# EAGLE design MEMS-preamp_v06_INPROGRESS (EAGLE 8.5.0)
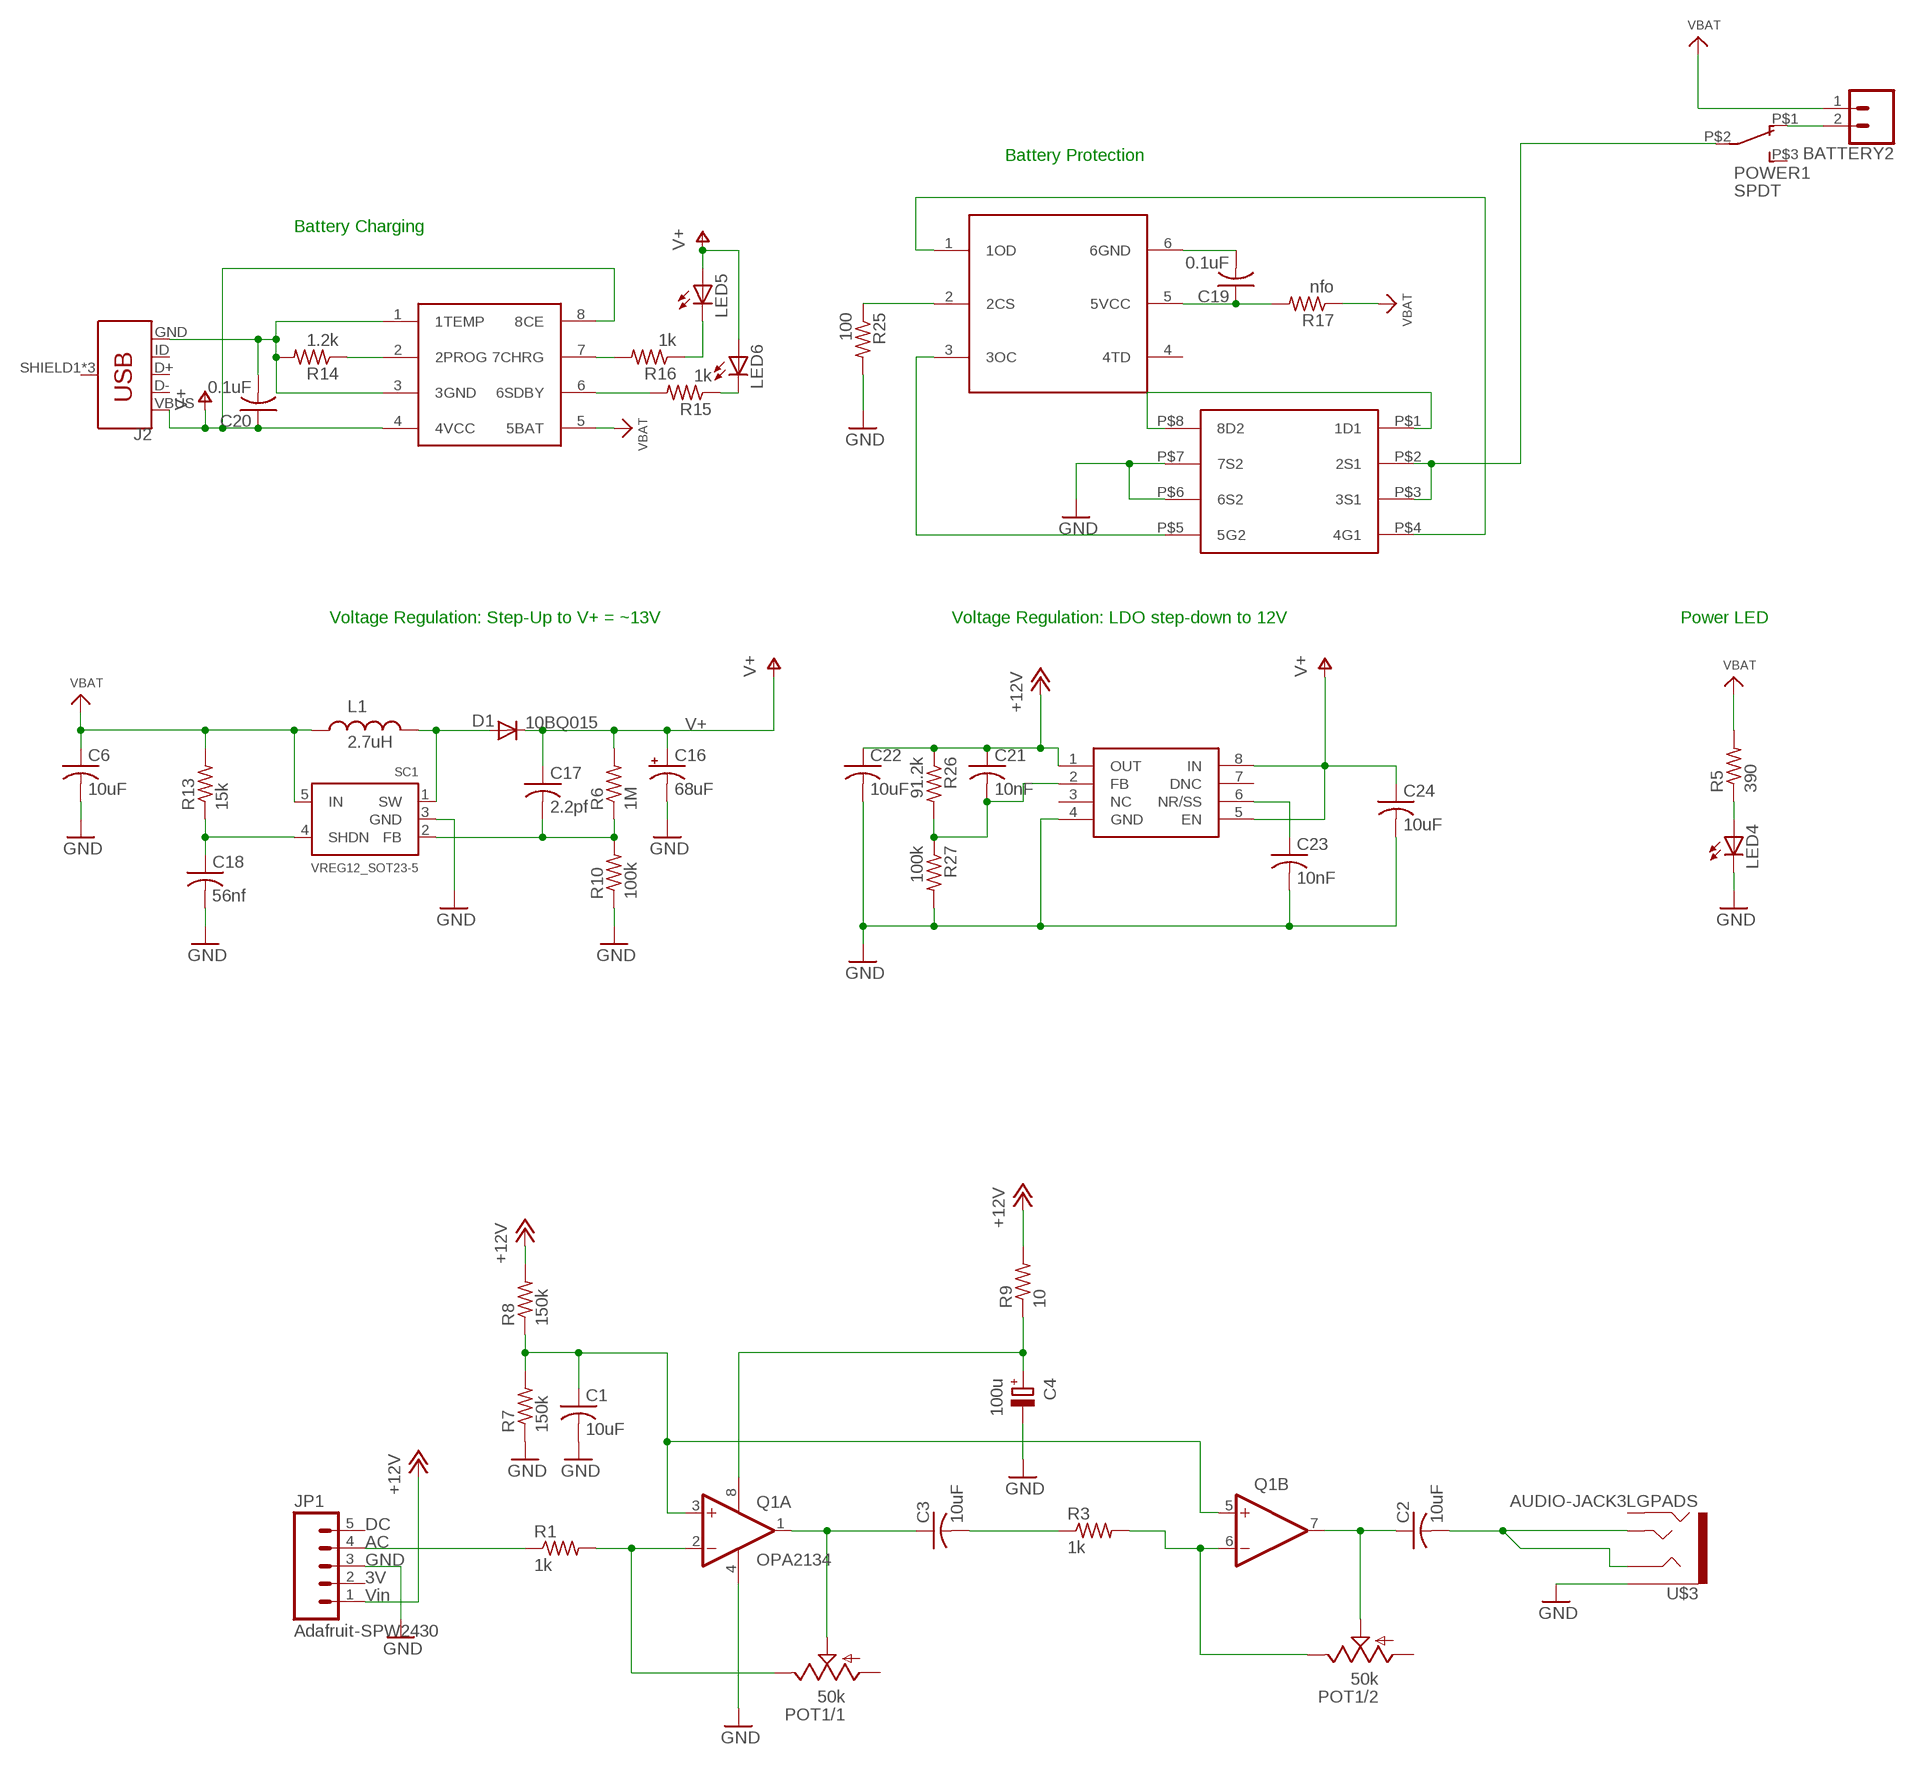
[diagram p0: schematic, sheet 1]

## Parts
BATTERY2  CONN_02LOCK  [1X02_LOCK]
C1  10uF  C-USC0603  [C0603]
C2  10uF  C-USC0603  [C0603]
C3  10uF  C-USC0805  [C0805]
C4  100u  CPOL-EUCT7343  [CT7343]
C6  10uF  C-USC0805  [C0805]
C16  68uF  CAP_POL3528  [EIA3528]
C17  2.2pf  C-USC0805  [C0805]
C18  56nf  C-USC0805  [C0805]
C19  0.1uF  C-USC0805  [C0805]
C20  0.1uF  C-USC0805  [C0805]
C21  10nF  C-USC0805  [C0805]
C22  10uF  C-USC0805  [C0805]
C23  10nF  C-USC0805  [C0805]
C24  10uF  C-USC0805  [C0805]
D1  10BQ015  DIODESMA  [SMA-DIODE]
DW01A1  DW01A  [SOT23-6]
F8205A1  F8205A  [F8205A]
J2  USB_MICRO-BREDUCED_PASTE  [USB-B-MICRO-SMD_RED_PASTE]
JP1  Adafruit-SPW2430  M05LOCK  [1X05_LOCK]
L1  2.7uH  INDUCTORCR54  [CR54]
LED4  LED3MM  [LED3MM]
LED5  LED3MM  [LED3MM]
LED6  LED3MM  [LED3MM]
POT1  50k  POT-DUAL-PTV112-4420  [PTV112]
POWER1  SPDT  SWITCH_SPDTCL-SB-12B  [SWITCH_SPDT_CL-SB-12B]
Q1  OPA2134  OPA2134UA  [SO08]
R1  1k  R-US_R0603  [R0603]
R3  1k  R-US_R0603  [R0603]
R5  390  R-US_R0805  [R0805]
R6  1M  R-US_R0603  [R0603]
R7  150k  R-US_R0603  [R0603]
R8  150k  R-US_R0603  [R0603]
R9  10  R-US_R0603  [R0603]
R10  100k  R-US_R0603  [R0603]
R13  15k  R-US_R0603  [R0603]
R14  1.2k  R-US_R0603  [R0603]
R15  1k  R-US_R0603  [R0603]
R16  1k  R-US_R0603  [R0603]
R17  nfo  R-US_R0603  [R0603]
R25  100  R-US_R0603  [R0603]
R26  91.2k  R-US_R0603  [R0603]
R27  100k  R-US_R0603  [R0603]
SC1  VREG12_SOT23-5  [SOT23-5]
TP1  TP4056-CHIP  [SO08]
U$3  AUDIO-JACK3LGPADS  [TRRS_SJ-43514-SMT-TR]
U$13  TPS7A49  [MSOP-8]

## Nets
+12V: C21.1 C22.1 JP1.1 R8.2 R9.2 R26.1 U$13.1(OUT)
GND: C1.2 C4.- C6.2 C16.C(-) C18.2 C22.2 C23.2 C24.2 F8205A1.P$6(6S2) F8205A1.P$7(7S2) JP1.3 LED4.K(C) Q1.4(A:V-) R7.1 R10.1 R25.2 R27.2 SC1.3(GND) U$3.EARTH U$13.4(GND)
GROU[: POT1.2.3(/2:E) Q1.6(B:-IN) R3.2
N$1: C4.+ Q1.8(A:V+) R9.1
N$2: LED4.A R5.1
N$3: JP1.4 R1.1
N$4: C3.2 R3.1
N$5: POT1.1.3(/1:E) Q1.2(A:-IN) R1.2
N$6: F8205A1.P$2(2S1) F8205A1.P$3(3S1) POWER1.P$2
N$7: C2.2 U$3.RING1 U$3.TIP
N$8: C1.1 Q1.3(A:+IN) Q1.5(B:+IN) R7.2 R8.1
N$9: C3.1 POT1.1.2(/1:S) Q1.1(A:OUT)
N$10: C2.1 POT1.2.2(/2:S) Q1.7(B:OUT)
N$11: BATTERY2.2 POWER1.P$1
N$12: D1.A L1.P$2 SC1.1(SW)
N$13: C18.1 R13.1 SC1.4(SHDN)
N$14: C17.2 R6.1 R10.2 SC1.2(FB)
N$15: C20.2 J2.GND R14.2 TP1.1(1TEMP) TP1.3(3GND)
N$16: R14.1 TP1.2(2PROG)
N$17: R16.2 TP1.7(7CHRG)
N$19: R15.2 TP1.6(6SDBY)
N$22: LED6.K(C) R15.1
N$23: LED5.K(C) R16.1
N$24: DW01A1.1(1OD) F8205A1.P$4(4G1)
N$25: DW01A1.3(3OC) F8205A1.P$5(5G2)
N$27: C19.1 DW01A1.5(5VCC) R17.2
N$31: C19.2 DW01A1.6(6GND)
N$45: DW01A1.2(2CS) R25.1
N$46: F8205A1.P$1(1D1) F8205A1.P$8(8D2)
N$47: C21.2 R26.2 R27.1 U$13.2(FB)
N$48: C23.1 U$13.6(NR/SS)
V+: C16.A(+) C17.1 C20.1 C24.1 D1.C J2.VBUS LED5.A LED6.A R6.2 TP1.4(4VCC) TP1.8(8CE) U$13.5(EN) U$13.8(IN)
VBAT: BATTERY2.1 C6.1 L1.P$1 R5.2 R13.2 R17.1 SC1.5(IN) TP1.5(5BAT)
Unconnected: DW01A1.4(4TD) J2.D+ J2.D- J2.ID J2.SHIELD1(SHIELD) J2.SHIELD2(SHIELD) J2.SHIELD3(SHIELD) JP1.2 JP1.5 POT1.1.1(/1:A) POT1.2.1(/2:A) POWER1.P$3 U$3.RING2 U$13.3(NC) U$13.7(DNC)

## Notes on the sheet
- Battery Protection
- Battery Charging
- Voltage Regulation: Step-Up to V+ = ~13V | Voltage Regulation: LDO step-down to 12V | Power LED

## Library data of the parts
BATTERY2 = SparkFun-Connectors:CONN_02: Multi connection point. Often used as Generic Header-pin footprint for 0.1 inch spaced/style header connections On any of the 0.1 inch spaced packages, you can populate with these: Break Away Headers - Straight <https://www.sparkfun.com/products/116> (PRT-00116) Break Away Male Headers - Right Angle <https://www.sparkfun.com/products/553> (PRT-00553) Female Headers <https://www.sparkfun.com/products/115> (PRT-00115) Break Away Headers - Machine Pin <https://www.sparkfun.com/products/117> (PRT-00117) Break Away Female Headers - Swiss Machine Pin <https://www.sparkfun.com/products/743> (PRT-00743) For SCREWTERMINALS and SPRING TERMINALS visit here: Screw Terimnals on SparkFun.com <https://www.sparkfun.com/search/results?term=Screw+Terminals> (5mm/3.5mm/2.54mm spacing) This device is also useful as a general connection point to wire up your design to another part of your project. Our various solder wires solder well into these plated through hole pads. Hook-Up Wire - Assortment (Stranded, 22 AWG) <https://www.sparkfun.com/products/11375> (PRT-11375) Hook-Up Wire - Assortment (Solid Core, 22 AWG) <https://www.sparkfun.com/products/11367> (PRT-11367) View the entire wire category on our website here <https://www.sparkfun.com/categories/141> Special notes: Molex polarized connector foot print use with: PRT-08233 with associated crimp pins and housings. 2.54_SCREWTERM for use with PRT-10571. 3.5mm Screw Terminal footprints for PRT-08084 5mm Screw Terminal footprints for use with PRT-08432
C1-C3 C6 C17-C24 = adafruit:C-US: CAPACITOR, American symbol
C4 = rcl:CPOL-EU: POLARIZED CAPACITOR, European symbol
C16 = SparkFun:CAP_POL: Capacitor Polarized These are standard SMD and PTH capacitors. Normally 10uF, 47uF, and 100uF in electrolytic and tantalum varieties. Always verify the external diameter of the through hole cap, it varies with capacity, voltage, and manufacturer. The EIA devices should be standard.
D1 = SparkFun:DIODE: Diode These are standard reverse protection diodes and small signal diodes. SMA package can handle up to about 1A. SOD-323 can handle about 200mA. What the SOD-323 package when ordering, there are some mfgs out there that are 5-pin packages.
DW01A1 = CMU-ArtFab:DW01A
F8205A1 = CMU-ArtFab:F8205A
J2 = SparkFun-Connectors:USB_MICRO-B: USB Type Micro-B Connector Male/female and PTH/SMT variants SparkFun Products: SparkFun microB USB Breakout <https://www.sparkfun.com/products/12035> SparkFun USB microB Plug Breakout <https://www.sparkfun.com/products/10031> SparkFun ESP8266 Thing <https://www.sparkfun.com/products/13231>; PROD_ID: CONN-11752
JP1 = SparkFun-Connectors:M05: Header 5 Standard 5-pin 0.1" header. Use with straight break away headers (SKU : PRT-00116), right angle break away headers (PRT-00553), swiss pins (PRT-00743), machine pins (PRT-00117), and female headers (PRT-00115). Molex polarized connector foot print use with SKU : PRT-08230 with associated crimp pins and housings.; CON1: Vin; CON2: 3V; CON3: GND; CON4: AC; CON5: DC
L1 = SparkFun:INDUCTOR: Inductors Basic Inductor/Choke - 0603 and 1206. Footprints are not proven and vary greatly between part numbers.
LED4-LED6 = led:LED: LED OSRAM: - CHIPLED LG R971, LG N971, LY N971, LG Q971, LY Q971, LO R971, LY R971 LH N974, LH R974 LS Q976, LO Q976, LY Q976 LO Q996 - Hyper CHIPLED LW Q18S LB Q993, LB Q99A, LB R99A - SideLED LS A670, LO A670, LY A670, LG A670, LP A670 LB A673, LV A673, LT A673, LW A673 LH A674 LY A675 LS A676, LA A676, LO A676, LY A676, LW A676 LS A679, LY A679, LG A679 - Hyper Micro SIDELED® LS Y876, LA Y876, LO Y876, LY Y876 LT Y87S - SmartLED LW L88C, LW L88S LB L89C, LB L89S, LG L890 LS L89K, LO L89K, LY L89K LS L896, LA L896, LO L896, LY L896 - TOPLED LS T670, LO T670, LY T670, LG T670, LP T670 LSG T670, LSP T670, LSY T670, LOP T670, LYG T670 LG T671, LOG T671, LSG T671 LB T673, LV T673, LT T673, LW T673 LH T674 LS T676, LA T676, LO T676, LY T676, LB T676, LH T676, LSB T676, LW T676 LB T67C, LV T67C, LT T67C, LS T67K, LO T67K, LY T67K, LW E67C LS E67B, LA E67B, LO E67B, LY E67B, LB E67C, LV E67C, LT E67C LW T67C LS T679, LY T679, LG T679 LS T770, LO T770, LY T770, LG T770, LP T770 LB T773, LV T773, LT T773, LW T773 LH T774 LS E675, LA E675, LY E675, LS T675 LS T776, LA T776, LO T776, LY T776, LB T776 LHGB T686 LT T68C, LB T68C - Hyper Mini TOPLED® LB M676 - Mini TOPLED Santana® LG M470 LS M47K, LO M47K, LY M47K Source: http://www.osram.convergy.de LUXEON: - LUMILED® LXK2-PW12-R00, LXK2-PW12-S00, LXK2-PW14-U00, LXK2-PW14-V00 LXK2-PM12-R00, LXK2-PM12-S00, LXK2-PM14-U00 LXK2-PE12-Q00, LXK2-PE12-R00, LXK2-PE12-S00, LXK2-PE14-T00, LXK2-PE14-U00 LXK2-PB12-K00, LXK2-PB12-L00, LXK2-PB12-M00, LXK2-PB14-N00, LXK2-PB14-P00, LXK2-PB14-Q00 LXK2-PR12-L00, LXK2-PR12-M00, LXK2-PR14-Q00, LXK2-PR14-R00 LXK2-PD12-Q00, LXK2-PD12-R00, LXK2-PD12-S00 LXK2-PH12-R00, LXK2-PH12-S00 LXK2-PL12-P00, LXK2-PL12-Q00, LXK2-PL12-R00 Source: www.luxeon.com KINGBRIGHT: KA-3528ASYC Source: www.kingbright.com
POT1 = CMU-ArtFab:POT-DUAL-PTV112: Bourns 11mm dual potentiometer; AVAILABILITY: Unavailable; DESCRIPTION: Alt# Tce-10111410; MF: STMicroelectronics; MP: PTV112; PACKAGE: None; PRICE: None
POWER1 = CMU-ArtFab:SWITCH_SPDT
Q1 = linear:OPA2*: Dual Operational Amplifier Low Power, Single-Supply, Rail-To-Rail Operational Amplifier Source: http://focus.ti.com/lit/ds/symlink/opa2345.pdf http://focus.ti.com .. opa241.pdf http://focus.ti.com/lit/ds/symlink/opa2134.pdf; IC_NAME: OPA2134
R1 R3 R5-R10 R13-R17 R25-R27 = CMU-ArtFab:R-US_: RESISTOR, American symbol
SC1 = CMU-ArtFab:VREG12_SOT23-5: SOT23-5 Fixed Voltage Regulators To better organise some of the SOT23-5 fixed voltage regulators in this library, this new part was created. Part Current Out V Out V In V Dropout Digikey Part No. ADP121 150mA 3.3V 3.4-5.5V 0.09V @ 150mA ADP121-AUJZ33R7CT-ND ADP121 150mA 3.0V 3.1-5.5V 0.09V @ 150mA ADP121-AUJZ30R7CT-ND ADP122 300mA 3.3V 3.4-5.5V 0.085V @ 300mA ADP122AUJZ-3.3-R7CT-ND ADP1712 300mA 3.3V 3.5-5.5V 0.17V @ 300mA ADP1712AUJZ-3.3-R7TR-ND AP7311 (Low Cost) 150mA 3.3V 3.5-6V 0.15V @ 150mA AP7311-33WG-7DICT-ND LD39015M18R 150mA 1.8V 1.9V-5.5V 0.08V @ 100mA 497-6977-1-ND MCP1824T-3302E/OT 300mA 3.3V 3.5V-6V 0.2V @ 300mA MCP1824T-3302E/OTCT-ND MIC5205-2.5YM5 TR 150mA 2.5V 2.7-16V 0.165V @ 150mA 576-1257-2-ND MIC5205-3.0YM5 TR 150mA 3.0V 3.2V-16V 0.165V @ 150mA 576-1258-2-ND MIC5205-3.3YM5 TR 150mA 3.3V 3.5V-16V 0.165V @ 150mA 576-1259-2-ND TPS780330220 150mA 3.3V+2.2V 3.6-5.5V 250mV Max 296-23332-1-ND TDA3663/N1,135 100mA 3.3V 3.5-45V 0.18V @ 50mA 568-5343-1-ND
TP1 = CMU-ArtFab:TP4056-CHIP
U$3 = CMU-ArtFab:AUDIO-JACK3: Audio jack - 3.5mm TRRS variety - two rings.
U$13 = CMU-ArtFab:TPS7A49

## Board
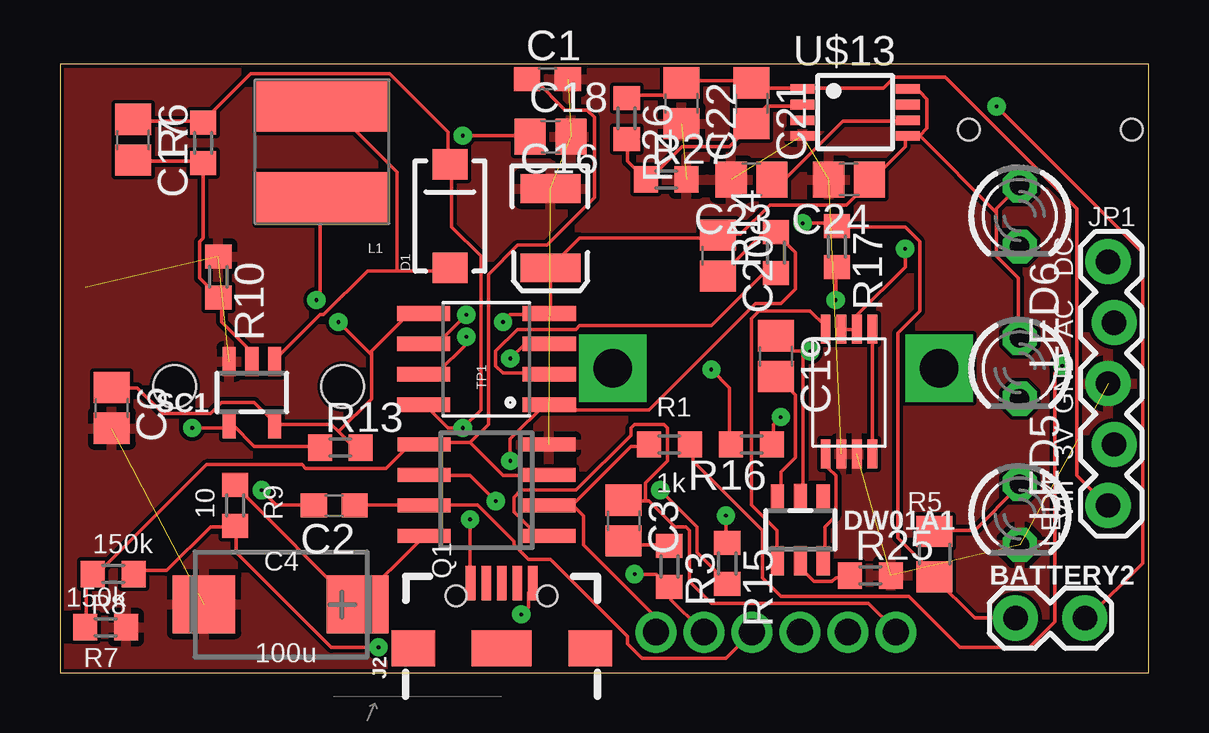
[diagram p1: board, top side]
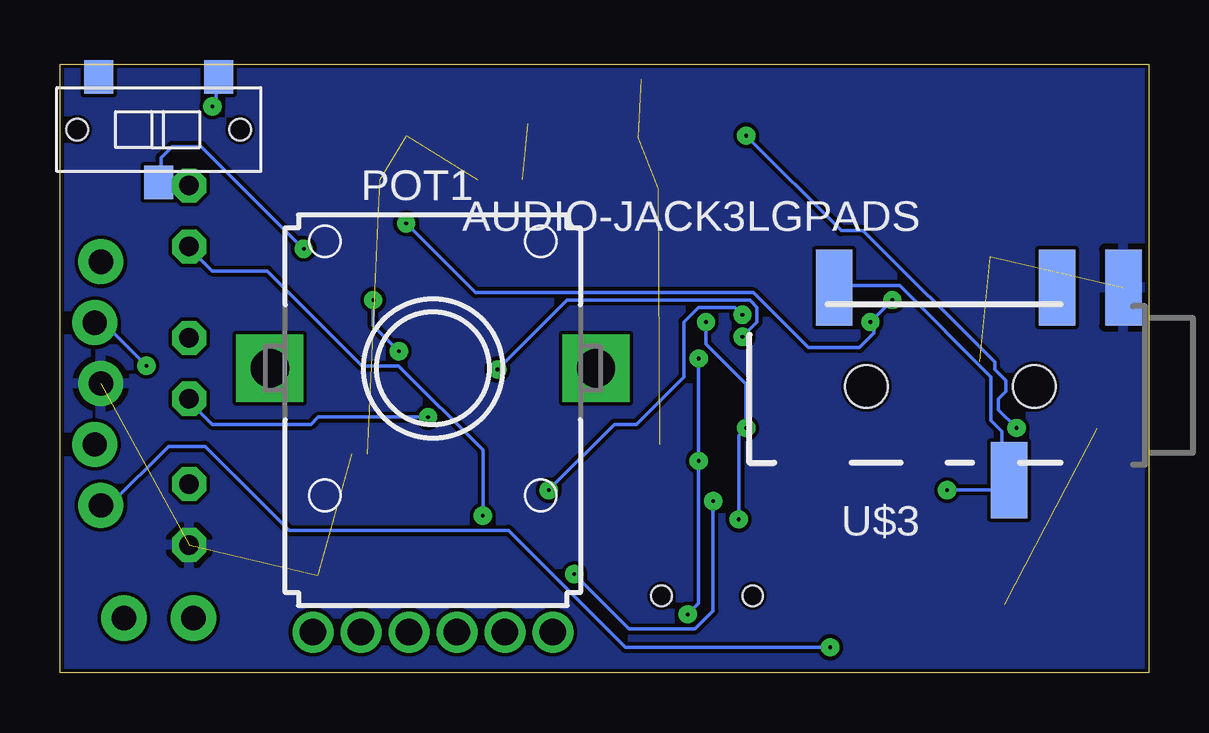
[diagram p2: board, bottom side, seen from below]

Size 45.39 x 25.39 mm. Coordinates in mm from the lower left corner, seen from the top.
Outline: 0,0 45.39,0 45.39,25.39 0,25.39 0,0
Copper layers (1*16): Top 0.035mm / dielectric 1.5mm / Bottom 0.035mm
Design rules "default *": minimum track width 6mil, minimum drill 6mil, track to track 6mil, track to pad 6mil, pad to pad 6mil, via to via 6mil, smd to smd 6mil, copper to edge 6mil, drill to drill 6mil, minimum pad ring 12mil, minimum via ring 12mil, stop-mask expansion 4mil, vias tented up to drill 0mil, thermal gap 10mil

### Footprints (pad centres in the part's own frame; a part is rotated, then mirrored left to right if it is on the bottom)
1X02_LOCK = drill 1.016 pad 1.88: 1 -0.178,0; 2 2.718,0
C0603 = smd 1.1 x 1: 1 -0.85,0; 2 0.85,0
C0805 = smd 1.3 x 1.5: 1 -0.85,0; 2 0.85,0
CT7343 = smd 2.6 x 2.4: + -3.2,0; - 3.2,0
EIA3528 = smd 1.2 x 2.5: A 1.65,0; C -1.65,0
SMA-DIODE = smd 1.27 x 1.47: A -2.15,0; C 2.15,0
SOT23-6 = smd 0.55 x 1.2: 1 -0.95,-1.3; 2 0,-1.3; 3 0.95,-1.3; 4 0.95,1.3; 5 0,1.303; 6 -0.95,1.3
F8205A = smd 0.406 x 1.2: P$1 -0.975,-2.65; P$2 -0.325,-2.65; P$3 0.325,-2.65; P$4 0.975,-2.65; P$5 0.975,2.55; P$6 0.325,2.55; P$7 -0.325,2.55; P$8 -0.975,2.55
USB-B-MICRO-SMD_RED_PASTE = smd 1.45 x 0.4: D+ 2.725,0; D- 2.725,0.65; GND 2.725,-1.3; ID 2.725,-0.65; VBUS 2.725,1.3 | smd 1.5 x 1.8: SHIELD1 0,3.685; SHIELD2 0,-3.685 | smd 1.5 x 2.5: SHIELD3 0,0 | hole 0.85: 2.2,1.9; 2.2,-1.9
1X05_LOCK = drill 1.016 pad 1.88: 1 0,0.127; 2 2.54,-0.127; 3 5.08,0.127; 4 7.62,-0.127; 5 10.16,0.127
CR54 = smd 5.5 x 2.15: P$1 0,1.92; P$2 0,-1.92
LED3MM = drill 0.813 octagon: A -1.27,0; K 1.27,0
PTV112 = drill 1.1 pad 1.676: 1.1 -3,-11; 1.2 -5,-11; 1.3 5,-11; 2.1 -1,-11; 2.2 1,-11; 2.3 3,-11 | drill 1.6 pad 2.8 square: M1 -6.8,0; M2 6.8,0
SWITCH_SPDT_CL-SB-12B = smd 1.2 x 1.4: P$1 -2.5,-2.2; P$2 0,2.2; P$3 2.5,-2.2 | hole 0.9: -3.4,0; 3.4,0
SO08 = smd 0.6 x 2.2: 1 -1.905,-2.6; 2 -0.635,-2.6; 3 0.635,-2.6; 4 1.905,-2.6; 5 1.905,2.6; 6 0.635,2.6; 7 -0.635,2.6; 8 -1.905,2.6
R0603 = smd 1 x 1.1: 1 -0.85,0; 2 0.85,0
R0805 = smd 1.3 x 1.5: 1 -0.95,0; 2 0.95,0
SOT23-5 = smd 0.55 x 1.2: 1 -0.95,-1.3; 2 0,-1.3; 3 0.95,-1.3; 4 0.95,1.3; 5 -0.95,1.3
SO08' = smd 0.61 x 2.21: 1 -1.905,-2.616; 2 -0.635,-2.616; 3 0.635,-2.616; 4 1.905,-2.616; 5 1.905,2.616; 6 0.635,2.616; 7 -0.635,2.616; 8 -1.905,2.616
TRRS_SJ-43514-SMT-TR = smd 1.524 x 3.175: EARTH -2.114,-5.271; RING1 2.644,2.759; RING2 0.66,-5.271; TIP 9.948,-5.271 | hole 1.778: 1.6,-1.15; 8.6,-1.15
MSOP-8 = smd 0.4 x 1: 1 -0.975,-2.2; 2 -0.325,-2.2; 3 0.325,-2.2; 4 0.975,-2.2; 5 0.975,2.2; 6 0.325,2.2; 7 -0.325,2.2; 8 -0.975,2.2

### Placement (x,y rotation side)
BATTERY2  40.01,2.29 0 top
C1  20.32,24.77 0 top
C2  11.43,6.99 180 top
C3  23.5,6.35 270 top
C4  9.21,2.86 180 top
C6  2.16,11.05 270 top
C16  20.45,18.54 270 top
C17  3.05,22.23 270 top
C18  20.45,22.35 0 top
C19  29.84,13.21 270 top
C20  27.43,17.4 270 top
C21  28.83,23.75 270 top
C22  25.91,23.75 270 top
C23  28.83,20.57 180 top
C24  32.89,20.57 180 top
D1  16.26,19.05 90 top
DW01A1  30.86,5.97 0 top
F8205A1  32.89,11.68 180 top
J2  18.41,1.02 90 top
JP1  43.81,6.99 90 top
L1  10.92,21.72 180 top
LED4  40.01,6.6 270 top
LED5  40.01,12.7 270 top
LED6  40.01,19.05 270 top
POT1  29.84,12.7 0 bottom
POWER1  41.27,22.66 180 bottom
Q1  17.78,7.62 90 top
R1  25.4,9.53 180 top
R3  25.4,4.45 270 top
R5  36.45,4.95 270 top
R6  5.97,22.1 90 top
R7  1.91,1.91 180 top
R8  2.22,4.13 0 top
R9  7.3,6.99 270 top
R10  6.6,16.51 270 top
R13  11.68,9.4 0 top
R14  29.84,17.53 90 top
R15  27.81,4.57 270 top
R16  28.83,9.53 180 top
R17  32.38,17.78 270 top
R25  33.78,4.06 0 top
R26  23.62,23.11 270 top
R27  25.27,20.57 0 top
SC1  8,11.68 180 top
TP1  TP4056-CHIP  [SO08']  17.78,13.08 90 top
U$3  3.17,10.79 180 bottom
U$13  33.15,23.37 270 top

### Tracks (layer width: path | path; a pad name or v marks a point on that pad's centre or on a via)
+12V  (via drill 0.15)
  Top 0.152: R26.1 23.65,24.08 25.32,24.08 25.78,24.54 C22.1 25.93,24.69 28.83,24.69 C21.1 28.83,24.54 28.98,24.38 30.81,24.38 U$13.1 30.96,24.38 34.31,24.38 34.77,24.84 36.91,24.84 42.39,19.36 42.39,8.23 43.61,7.01 JP1.1 | R8.2 3.07,4.27 4.45,4.27 6.27,6.1 7.19,6.1 R9.2 7.34,6.1 7.34,5.03 11.3,1.07 v13.28,1.07
  Bottom 0.152: v13.28,1.07 21.82,1.07 26.7,5.94 35.84,5.94 39.34,9.45 40.87,9.45 43.31,7.01 43.61,7.01 JP1.1
GND  (13 unrouted)
  Top 0.152: 26.24,20.57 R27.2
  pour Bottom: -2.54,-2.54 47.62,-2.54 47.62,27.94 -2.54,27.94
  pour Top: -1.27,26.67 46.35,26.67 46.35,-1.27 -1.27,-1.27
GROU[  (via drill 0.15)
  Top 0.152: POT1.2.3 26.7,1.83 25.48,3.05 25.48,3.5 R3.2 25.32,3.66 24.87,4.12 v23.95,4.12 | v18.16,7.16 17.09,8.23 15.27,8.23 Q1.6
  Bottom 0.152: v18.16,7.16 18.16,2.59 18.92,1.83 21.67,1.83 v23.95,4.12
N$1
  Top 0.152: R9.1 7.34,7.77 12.37,2.74 C4.+ 12.37,2.9 15.11,5.64 Q1.8
N$2
  Top 0.152: R5.1 36.45,5.94 38.12,5.94 39.95,7.77 LED4.A
N$3  (via drill 0.15)
  Top 0.152: v41.78,12.8 41.48,12.5 41.48,2.13 40.41,1.07 37.52,1.07 35.38,3.2 30.05,3.2 29.29,3.96 29.29,5.94 26.39,8.84 26.39,9.45 R1.1
  Bottom 0.152: v41.78,12.8 43.46,14.48 43.92,14.48 JP1.4
N$4
  Top 0.152: R3.1 25.32,5.33 23.65,5.33 23.5,5.49 C3.2
N$5
  Top 0.152: 21.36,7.01 23.8,9.45 24.41,9.45 R1.2 | 21.36,7.01 20.45,7.01 Q1.2 21.36,7.01 | 21.36,7.01 21.82,6.55 21.82,5.33 24.71,2.44 24.71,1.83 POT1.1.3
N$6  (via drill 0.15)
  Top 0.152: F8205A1.P$3 32.64,14.33 33.1,14.33 F8205A1.P$2 33.25,14.48 33.25,14.94 35.23,16.92 v35.23,17.68
  Bottom 0.152: v35.23,17.68 39.5,21.95 40.72,21.95 41.17,21.49 41.17,20.57 POWER1.P$2
N$7  (via drill 0.15)
  Top 0.152: v8.41,7.62 9.02,7.01 10.54,7.01 C2.2
  Bottom 0.152: v8.41,7.62 6.27,7.62 5.97,7.92 U$3.RING1 5.97,8.08 6.12,8.23 6.12,10.06 6.58,10.52 6.58,12.34 10.39,16.15 12.98,16.15 U$3.TIP
N$8
  Top 0.152: R7.2 1.09,1.98 1.09,3.96 1.25,4.12 R8.1 1.4,4.27 1.7,4.27 6.12,8.69 10.08,8.69 10.24,8.53 13.59,8.53 14.5,9.45 15.11,9.45 Q1.5 15.27,9.6 17.09,9.6 | 17.09,9.6 17.86,10.36 17.86,16.61 19.07,17.83 20.3,17.83 22.28,19.81 22.28,23.16 21.97,23.47 21.06,23.47 19.84,24.69 19.53,24.69 C1.1 | 17.09,9.6 18.47,8.23 20.3,8.23 Q1.3
N$9
  Top 0.152: 24.41,7.16 24.56,7.16 25.63,6.1 26.09,6.1 26.24,5.94 26.24,3.81 27.15,2.9 33.71,2.9 34.77,1.83 POT1.1.2 | 24.41,7.16 23.5,7.16 C3.1 | 24.41,7.16 24.41,7.92 25.32,8.84 25.32,10.21 25.17,10.36 23.95,10.36 23.8,10.21 23.8,9.91 21.51,7.62 19.23,7.62 18.92,7.32 18.92,6.71 19.84,5.79 20.3,5.79 Q1.1
N$10
  Top 0.152: C2.1 12.37,7.01 15.11,7.01 Q1.7 15.27,7.01 17.4,7.01 18.92,5.49 18.92,5.33 19.53,4.72 20.45,4.72 23.65,1.52 23.65,1.22 24.26,0.61 27.76,0.61 28.83,1.68 POT1.2.2
N$11  (via drill 0.15)
  Top 0.152: v39.04,23.62 45.14,17.53 45.14,4.57 42.85,2.29 BATTERY2.2
  Bottom 0.152: v39.04,23.62 38.89,23.77 38.89,24.84 POWER1.P$1
N$12
  Top 0.152: 14.05,16.76 16.18,16.76 D1.A | 14.05,16.76 12.83,16.76 11,14.94 10.85,14.94 9.02,13.11 SC1.1 | 14.05,16.76 14.05,20.88 11.3,23.62 11,23.62 L1.P$2
N$13  (via drill 0.15)
  Top 0.152: R13.1 10.69,9.45 8.1,9.45 7.19,10.36 SC1.4 7.04,10.36 6.88,10.21 v5.51,10.21 | v16.79,22.4 19.53,22.4 C18.1
  Bottom 0.152: v16.79,22.4 12.83,18.44 11.91,18.44 6.43,12.95 6.43,12.65 5.97,12.19 5.97,11.73 6.27,11.43 6.27,10.97 v5.51,10.21
N$14
  Top 0.152: C17.2 3.07,21.34 5.97,21.34 R6.1 5.97,18.14 5.82,17.98 5.82,16.46 6.58,15.7 R10.2 6.73,15.54 6.73,14.63 7.95,13.41 7.95,13.11 SC1.2
N$15  (via drill 0.15)
  Top 0.152: C20.2 27.46,16.46 29.29,18.29 29.74,18.29 R14.2 29.9,18.29 30.66,17.53 30.66,16 30.05,15.39 28.98,15.39 24.56,10.97 20.6,10.97 TP1.1 20.3,11.28 18.77,9.75 v18.77,8.84 | v19.23,2.44 19.53,2.74 19.53,3.35 19.68,3.5 19.68,3.66 J2.GND | TP1.3 19.38,13.72 v18.77,13.11
  Bottom 0.152: v19.23,2.44 18.77,2.9 v18.77,8.84 v18.77,13.11
N$16
  Top 0.152: R14.1 29.74,16.61 29.29,16.61 27.15,14.48 21.67,14.48 21.51,14.33 19.07,14.33 18.16,13.41 18.16,12.8 18.47,12.5 20.3,12.5 TP1.2
N$17  (via drill 0.15)
  Top 0.152: v27.15,12.65 27.91,11.89 27.91,9.6 R16.2 | v16.94,14.02 16.94,13.72 15.72,12.5 15.27,12.5 TP1.7
  Bottom 0.152: v27.15,12.65 24.26,15.54 16.64,15.54 16.33,15.24 16.33,14.63 v16.94,14.02
N$19  (via drill 0.15)
  Top 0.152: v25.02,7.62 26.54,6.1 26.54,5.03 27.76,3.81 R15.2 | v16.94,14.94 15.72,13.72 TP1.6
  Bottom 0.152: v25.02,7.62 22.28,10.36 21.36,10.36 19.38,12.34 19.38,14.63 18.77,15.24 17.25,15.24 v16.94,14.94
N$22  (via drill 0.15)
  Top 0.152: v27.76,6.55 27.76,5.49 R15.1
  Bottom 0.152: v27.76,6.55 27.76,9.3 31.27,12.8 32.79,12.8 36.75,16.76 39.04,16.76 39.95,17.68 LED6.K
N$23  (via drill 0.15)
  Top 0.152: v30.05,10.67 29.74,10.36 29.74,9.6 R16.1
  Bottom 0.152: v30.05,10.67 34.62,10.67 34.92,10.36 39.04,10.36 40.11,11.43 LED5.K
N$24
  Top 0.152: DW01A1.1 29.9,4.72 29.9,5.94 28.83,7.01 28.83,14.78 29.13,15.09 31.27,15.09 31.88,14.48 F8205A1.P$4
N$25
  Top 0.152: DW01A1.3 31.88,4.72 31.88,6.1 32.33,6.55 32.33,8.23 32.03,8.53 32.03,8.99 F8205A1.P$5
N$27  (via drill 0.15)
  Top 0.152: v32.33,15.54 32.33,16.92 R17.2 | 30.96,13.41 30.5,13.41 29.9,14.02 C19.1 | 30.96,13.41 30.96,7.32 DW01A1.5 | 30.96,13.41 v31.27,13.41
  Bottom 0.152: v32.33,15.54 32.33,14.48 v31.27,13.41
N$31
  Top 0.152: DW01A1.6 30.05,7.32 30.05,8.38 30.66,8.99 30.66,11.58 29.9,12.34 C19.2
N$45
  Top 0.152: R25.1 32.79,3.96 32.33,3.96 32.18,3.81 31.42,3.81 30.96,4.27 30.96,4.57 DW01A1.2
N$46
  Top 0.152: F8205A1.P$8 33.86,9.14 33.86,14.33 F8205A1.P$1
N$47
  Top 0.152: R26.2 23.65,22.25 23.65,21.34 24.41,20.57 R27.1 24.56,20.57 25.93,21.95 27.91,21.95 28.83,22.86 C21.2 28.83,23.01 29.44,23.62 30.81,23.62 U$13.2
N$48
  Top 0.152: C23.1 30.2,20.57 32.64,23.01 35.23,23.01 U$13.6
V+  (via drill 0.15)
  Top 0.152: 33.86,20.57 35.23,21.95 35.23,22.25 U$13.5 | 35.84,22.4 36.14,22.71 36.14,23.93 35.84,24.23 35.38,24.23 U$13.8 | 35.84,22.4 35.38,22.4 U$13.5 | 39.04,19.2 39.04,19.36 LED6.A | 39.04,19.2 39.04,17.37 39.95,16.46 39.95,14.02 LED5.A | 39.04,19.2 35.84,22.4 | 35.84,22.4 U$13.5 | 33.86,20.57 32.79,19.51 29.59,19.51 28.37,18.29 27.46,18.29 C20.1 27.3,18.14 21.67,18.14 20.45,16.92 C16.A 20.45,15.09 TP1.4 20.3,14.94 18.77,14.94 v18.47,14.63 | 33.86,20.57 C24.1 | 5.97,23.01 3.07,23.01 C17.1 | v17.09,6.4 17.09,3.81 J2.VBUS | TP1.8 15.27,11.12 16.18,10.21 v16.79,10.21 17.55,10.97 17.55,17.37 16.33,18.59 16.33,21.18 D1.C 16.18,21.34 16.18,22.55 13.74,24.99 7.95,24.99 5.97,23.01 | 5.97,23.01 R6.2
  Bottom 0.152: v17.09,6.4 17.09,9.91 v16.79,10.21 16.79,12.04 18.47,13.72 v18.47,14.63
VBAT  (via drill 0.15)
  Top 0.152: BATTERY2.1 38.12,2.29 36.45,3.96 R5.2 36.45,4.12 34.92,5.64 34.92,14.17 35.84,15.09 35.84,17.98 35.23,18.59 32.49,18.59 R17.1 32.33,18.75 v30.96,18.75 | 11.61,10.06 11.3,10.36 9.02,10.36 SC1.5 8.87,10.52 8.1,11.28 6.73,11.28 6.27,10.82 4.29,10.82 3.23,11.89 2.16,11.89 C6.1 | 11.61,10.06 12.22,9.45 12.52,9.45 R13.2 | 12.98,13.26 12.98,11.43 11.61,10.06 | 12.98,13.26 12.98,13.41 14.5,14.94 15.11,14.94 TP1.5 | v10.69,15.54 10.85,15.7 10.85,19.66 L1.P$1 | 12.98,13.26 v11.61,14.63
  Bottom 0.152: v10.69,15.54 v11.61,14.63 11.46,14.48 11.46,14.17 12.06,13.56 14.2,13.56 16.48,15.85 28.07,15.85 v30.96,18.75